# Altium schematic sheet esp32wrom.SchDoc
size A4; SheetNumber: 1; SheetTotal: 1
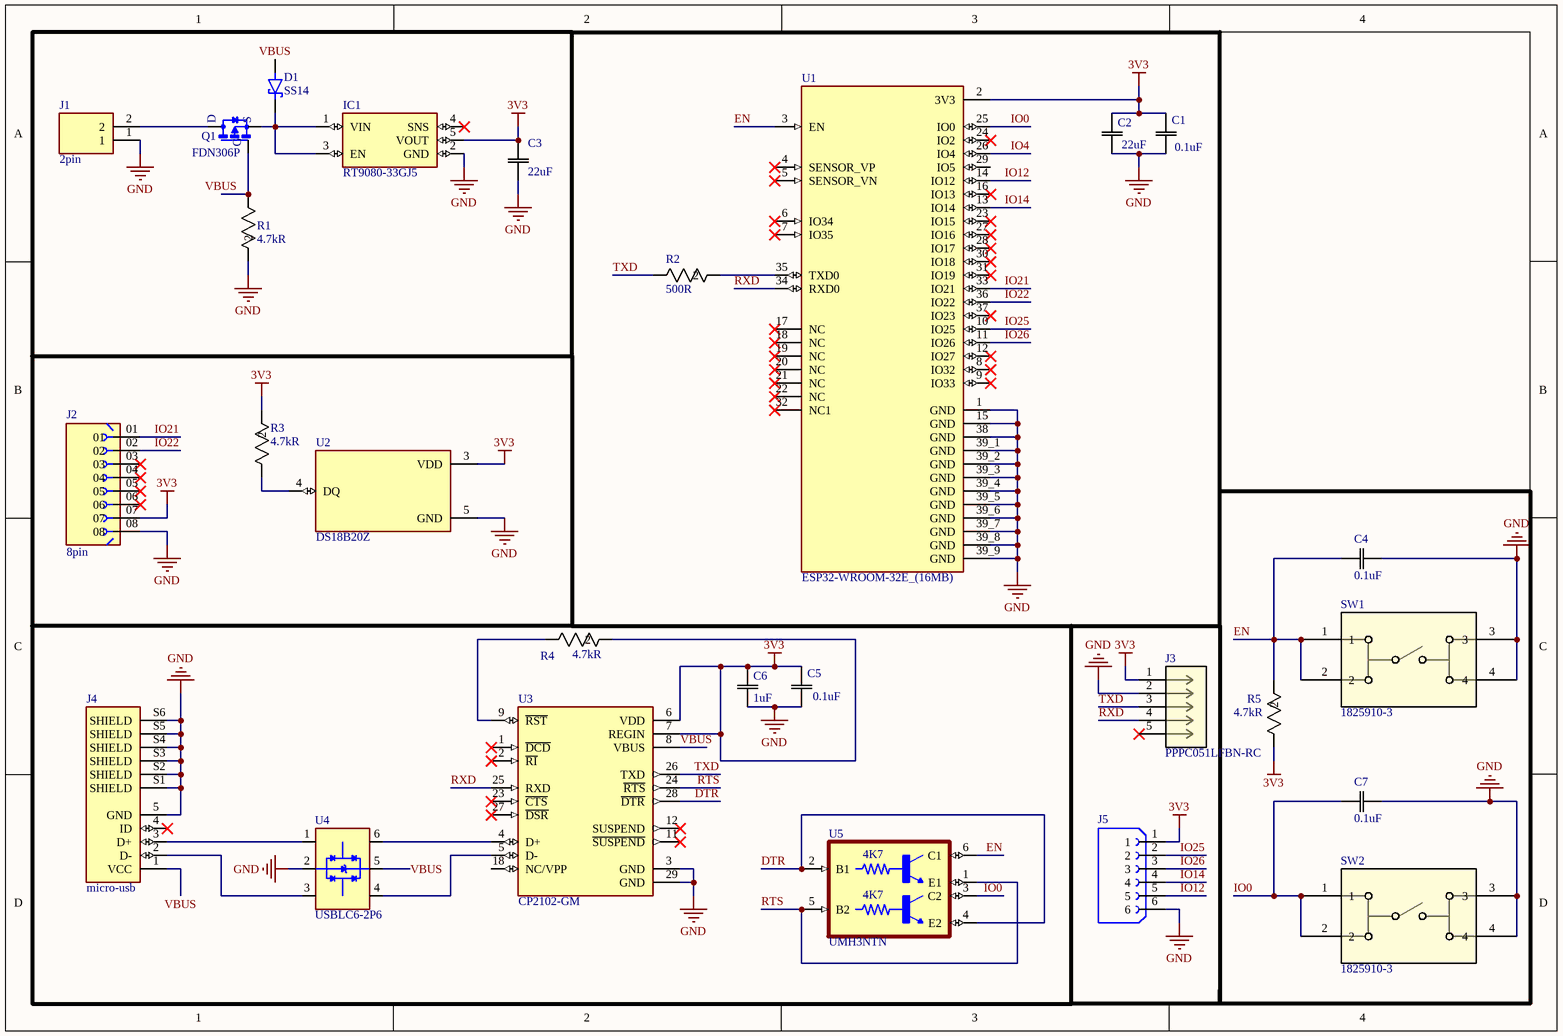
[diagram p0: esp32wrom.SchDoc]

## Parts
C1  0.1uF  [0603_AVX]
C2  22uF  [0603_AVX]
C3  22uF  [0603_AVX]
C4  0.1uF  [0603_AVX]
C5  0.1uF  [0603_AVX]
C6  1uF  [0603_AVX]
C7  0.1uF  [0603_AVX]
D1  SS14  [DIOM4325X250N]
IC1  RT9080-33GJ5  [SOT94P280X100-5N]
J1  2pin  [JST_S2B-PH-K-S(LF)(SN)]
J2  8pin  [AMPHENOL_76308-108LF]
J3  PPPC051LFBN-RC  [CONN_PPPC051LFBN-RC_SUL]
J4  micro-usb  [AMPHENOL_10118192-0002LF]
J5  6pin  [SULLINS_PPTC061LFBN-RC]  (value not drawn)
Q1  FDN306P  [SSOT-3]
R1  4.7kR  [RC0603N_PAN]
R2  500R  [RC0603N_PAN]
R3  4.7kR  [RC0603N_PAN]
R4  4.7kR  [RC0603N_PAN]
R5  4.7kR  [RC0603N_PAN]
SW1  1825910-3  [SW4_1825910-A_TEC]
SW2  1825910-3  [SW4_1825910-A_TEC]
U1  ESP32-WROOM-32E_(16MB)  [XCVR_ESP32-WROOM-32E_(16MB)]
U2  DS18B20Z  [SOIC127P600X175-8N]
U3  CP2102-GM  [QFN50P500X500X100-29N]
U4  USBLC6-2P6  [SOT50P160X60-6N]
U5  UMH3NTN  [SOP65P210X100-6N]

## Nets
3V3: C1.2 C2.2 C3.2 C5.2 C6.2 IC1.5(VOUT) J2.07 J3.1 J5.1 R3.2 R4.2 R5.1 U1.2(3V3) U2.3(VDD) U3.6(VDD) U3.7(REGIN)
GND: C1.1 C2.1 C3.1 C4.1 C5.1 C6.1 C7.1 IC1.2(GND) J1.1 J2.08 J3.2 J4.5(GND) J4.S1(SHIELD) J4.S2(SHIELD) J4.S3(SHIELD) J4.S4(SHIELD) J4.S5(SHIELD) J4.S6(SHIELD) J5.6 R1.2 SW1.3 SW1.4 SW2.3 SW2.4 U1.1(GND) U1.15(GND) U1.38(GND) U1.39_1(GND) U1.39_2(GND) U1.39_3(GND) U1.39_4(GND) U1.39_5(GND) U1.39_6(GND) U1.39_7(GND) U1.39_8(GND) U1.39_9(GND) U2.5(GND) U3.3(GND) U3.29(GND) U4.2(GND)
DTR: U3.28(~{DTR}) U5.2(B1) U5.4(E2)
EN: C4.2 R5.2 SW1.1 SW1.2 U1.3(EN) U5.6(C1)
IO0: C7.2 SW2.1 SW2.2 U1.25(IO0) U5.3(C2)
IO4: U1.26(IO4)
IO12: J5.5 U1.14(IO12)
IO14: J5.4 U1.13(IO14)
IO21: J2.01 U1.33(IO21)
IO22: J2.02 U1.36(IO22)
IO25: J5.2 U1.10(IO25)
IO26: J5.3 U1.11(IO26)
RTS: U3.24(~{RTS}) U5.1(E1) U5.5(B2)
RXD: J3.4 U1.34(RXD0) U3.25(RXD)
TXD: J3.3 R2.1 U3.26(TXD)
VBUS: D1.A J4.1(VCC) Q1.1(G) R1.1 U3.8(VBUS) U4.5(VBUS)
NetD1_C: D1.C(K) IC1.1(VIN) IC1.3(EN) Q1.2(S)
NetJ1_2: J1.2 Q1.3(D)
NetJ4_2: J4.2(D-) U4.3(I/O2_1)
NetJ4_3: J4.3(D+) U4.1(I/O1_1)
NetR2_2: R2.2 U1.35(TXD0)
NetR3_1: R3.1 U2.4(DQ)
NetR4_1: R4.1 U3.9(~{RST})
NetU3_4: U3.4(D+) U4.6(I/O1_2)
NetU3_5: U3.5(D-) U4.4(I/O2_2)

Not connected (* = marked no-connect by the designer): IC1 4(SNS)*; J2 03* 04* 05* 06*; J3 5*; J4 4(ID)*; U1 4(SENSOR_VP)* 5(SENSOR_VN)* 6(IO34)* 7(IO35)* 8(IO32)* 9(IO33)* 12(IO27)* 16(IO13)* 17(NC)* 18(NC)* 19(NC)* 20(NC)* 21(NC)* 22(NC)* 23(IO15)* 24(IO2)* 27(IO16)* 28(IO17)* 29(IO5) 30(IO18)* 31(IO19)* 32(NC1)* 37(IO23)*; U3 1(~{DCD})* 2(~{RI})* 11(~{SUSPEND})* 12(SUSPEND)* 18(NC/VPP) 23(~{CTS})* 27(~{DSR})*

## Notes on the sheet
- (in symbol UMH3NTN) 4K7

## Library data of the parts
C1-C7 = 0603: Description; Manufacturer_Name: KYOCERA AVX; Manufacturer_Part_Number: 0603YC683KAT2A; Copyright: Copyright (C) 2025 Ultra Librarian. All rights reserved.
D1 = SS14: 1A, 40V, Schottky Rectifier; MF: Taiwan Semiconductor; SnapEDA_Link: https://www.snapeda.com/parts/SS14/taiwan/view-part/?ref=snap; Package: SMA-2 Taiwan Semiconductor; Value: *; MP: SS14; Check_prices: https://www.snapeda.com/parts/SS14/taiwan/view-part/?ref=eda
IC1 = RT9080-33GJ5: Linear Voltage Regulator IC Positive Fixed 1 Output 600mA TSOT-23-5; MF: Richtek USA; SnapEDA_Link: https://www.snapeda.com/parts/RT9080-33GJ5/Richtek+USA+Inc./view-part/?ref=snap; Package: TSOT-23 Richtek; Value: *; MP: RT9080-33GJ5; Check_prices: https://www.snapeda.com/parts/RT9080-33GJ5/Richtek+USA+Inc./view-part/?ref=eda
J1 = 2pin: Connector Header Through Hole, Right Angle 2 position; MP: S2B-PH-K-S(LF)(SN); MF: JST Sales America Inc.; Price: None; Availability: In Stock; Package: None; Value: *; SnapEDA_Link: https://www.snapeda.com/parts/S2B-PH-K-S(LF)(SN)/JST+Sales+America+Inc./view-part/?ref=snap; Purchase-URL: https://pricing.snapeda.com/search/part/S2B-PH-K-S(LF)(SN)/?ref=eda; Check_prices: https://www.snapeda.com/parts/S2B-PH-K-S(LF)(SN)/JST+Sales+America+Inc./view-part/?ref=eda
J2 = 8pin: DuboxÂ® 2.54mm, Board to Board Connector, 8 Positions,Single Row,Vertical,2.54mm pitch,Card Connector; MP: 76308-108LF; MF: Amphenol; Value: *; Package: None; Check_prices: https://www.snapeda.com/parts/76308-108LF/Amphenol/view-part/?ref=eda; Purchase-URL: https://pricing.snapeda.com/search/part/76308-108LF/?ref=eda; Price: None; Availability: In Stock; SnapEDA_Link: https://www.snapeda.com/parts/76308-108LF/Amphenol/view-part/?ref=snap
J3 = 5pin: Description; Manufacturer_Name: Sullins; Copyright: Copyright (C) 2025 Ultra Librarian. All rights reserved.; Manufacturer_Part_Number: PPPC051LFBN-RC; RefDes: RefDes; Type: Type
J4 = micro-usb: Micro USB 2.0, Input Output Connectors, B TYPE RECEPTACLE without flange; MF: Amphenol ICC; MP: 10118192-0002LF; SnapEDA_Link: https://www.snapeda.com/parts/10118192-0002LF/Amphenol+FCI/view-part/?ref=snap; Package: None; Value: *; Check_prices: https://www.snapeda.com/parts/10118192-0002LF/Amphenol+FCI/view-part/?ref=eda
J5 = 6pin: 6 Position Total Single Row 2.54 mm Pitch Straight Female Header; MF: Sullins Connector Solutions; MP: PPTC061LFBNRC; SnapEDA_Link: https://www.snapeda.com/parts/PPTC061LFBNRC/Sullins/view-part/?ref=snap; Package: None; Value: *; Check_prices: https://www.snapeda.com/parts/PPTC061LFBNRC/Sullins/view-part/?ref=eda
Q1 = FDN306P: P-Channel 12V 2.6A (Ta) 500mW (Ta) Surface Mount SuperSOT-3; MF: ON Semiconductor; SnapEDA_Link: https://www.snapeda.com/parts/FDN306P/Onsemi/view-part/?ref=snap; Package: TO-236-3 ON; Value: *; MP: FDN306P; Check_prices: https://www.snapeda.com/parts/FDN306P/Onsemi/view-part/?ref=eda
R1-R5 = 0603: No Description Available; Manufacturer_Name: Panasonic; Manufacturer_Part_Number: ERJ-3GEYJ6R8V; Copyright: Copyright (C) 2025 Ultra Librarian. All rights reserved.
SW1 SW2 = 1825910-3: FSM2JAH=6MM TACT SWITCH, HIGH TEMP; Manufacturer_Name: TE Connectivity; Copyright: Copyright (C) 2025 Ultra Librarian. All rights reserved.; Manufacturer_Part_Number: 1825910-3; RefDes: RefDes; Type: Type
U1 = ESP32-WROOM-32E_(16MB): Bluetooth, WiFi 802.11b/g/n, Bluetooth v4.2 +EDR, Class 1, 2 and 3 Transceiver Module 2.4GHz ~ 2.5GHz Integrated, Trace Surface Mount; MP: ESP32-WROOM-32E (16MB); MF: Espressif Systems; Price: None; Availability: Not in stock; Package: None; Value: *; SnapEDA_Link: https://www.snapeda.com/parts/ESP32-WROOM-32E%20(16MB)/Espressif+Systems/view-part/?ref=snap; Check_prices: https://www.snapeda.com/parts/ESP32-WROOM-32E%20(16MB)/Espressif+Systems/view-part/?ref=eda
U2 = DS18B20Z: Programmable Resolution 1-Wire Digital Thermometer; MF: Analog Devices; MP: DS18B20Z+T&amp;R; SnapEDA_Link: https://www.snapeda.com/parts/DS18B20Z+T&R/Analog+Devices/view-part/?ref=snap; Package: SOIC-8 Maxim; Value: *; Check_prices: https://www.snapeda.com/parts/DS18B20Z+T&R/Analog+Devices/view-part/?ref=eda
U3 = CP2102-GM: USB Bridge, USB to UART USB 2.0 UART Interface 28-QFN (5x5); MF: Silicon Labs; SnapEDA_Link: https://www.snapeda.com/parts/CP2102-GM/Silicon+Labs/view-part/?ref=snap; Package: QFN-28 Silicon Labs; Value: *; MP: CP2102-GM; Check_prices: https://www.snapeda.com/parts/CP2102-GM/Silicon+Labs/view-part/?ref=eda
U4 = USBLC6-2P6: 17V Clamp 5A (8/20Âµs) Ipp Tvs Diode Surface Mount SOT-666; MF: STMicroelectronics; SnapEDA_Link: https://www.snapeda.com/parts/USBLC6-2P6/STMicroelectronics/view-part/?ref=snap; Package: SOT-666 STMicroelectronics; Value: *; MP: USBLC6-2P6; Check_prices: https://www.snapeda.com/parts/USBLC6-2P6/STMicroelectronics/view-part/?ref=eda
U5 = UMH3NTN: Pre-Biased Bipolar Transistor (BJT) 2 NPN - Pre-Biased (Dual) 50V 100mA 250MHz 150mW Surface Mount UMT6; MF: Rohm; SnapEDA_Link: https://www.snapeda.com/parts/UMH3NTN/Rohm/view-part/?ref=snap; Package: SOT-363 Rohm; Value: *; MP: UMH3NTN; Check_prices: https://www.snapeda.com/parts/UMH3NTN/Rohm/view-part/?ref=eda